# Altium project IMU V1.PrjPcb
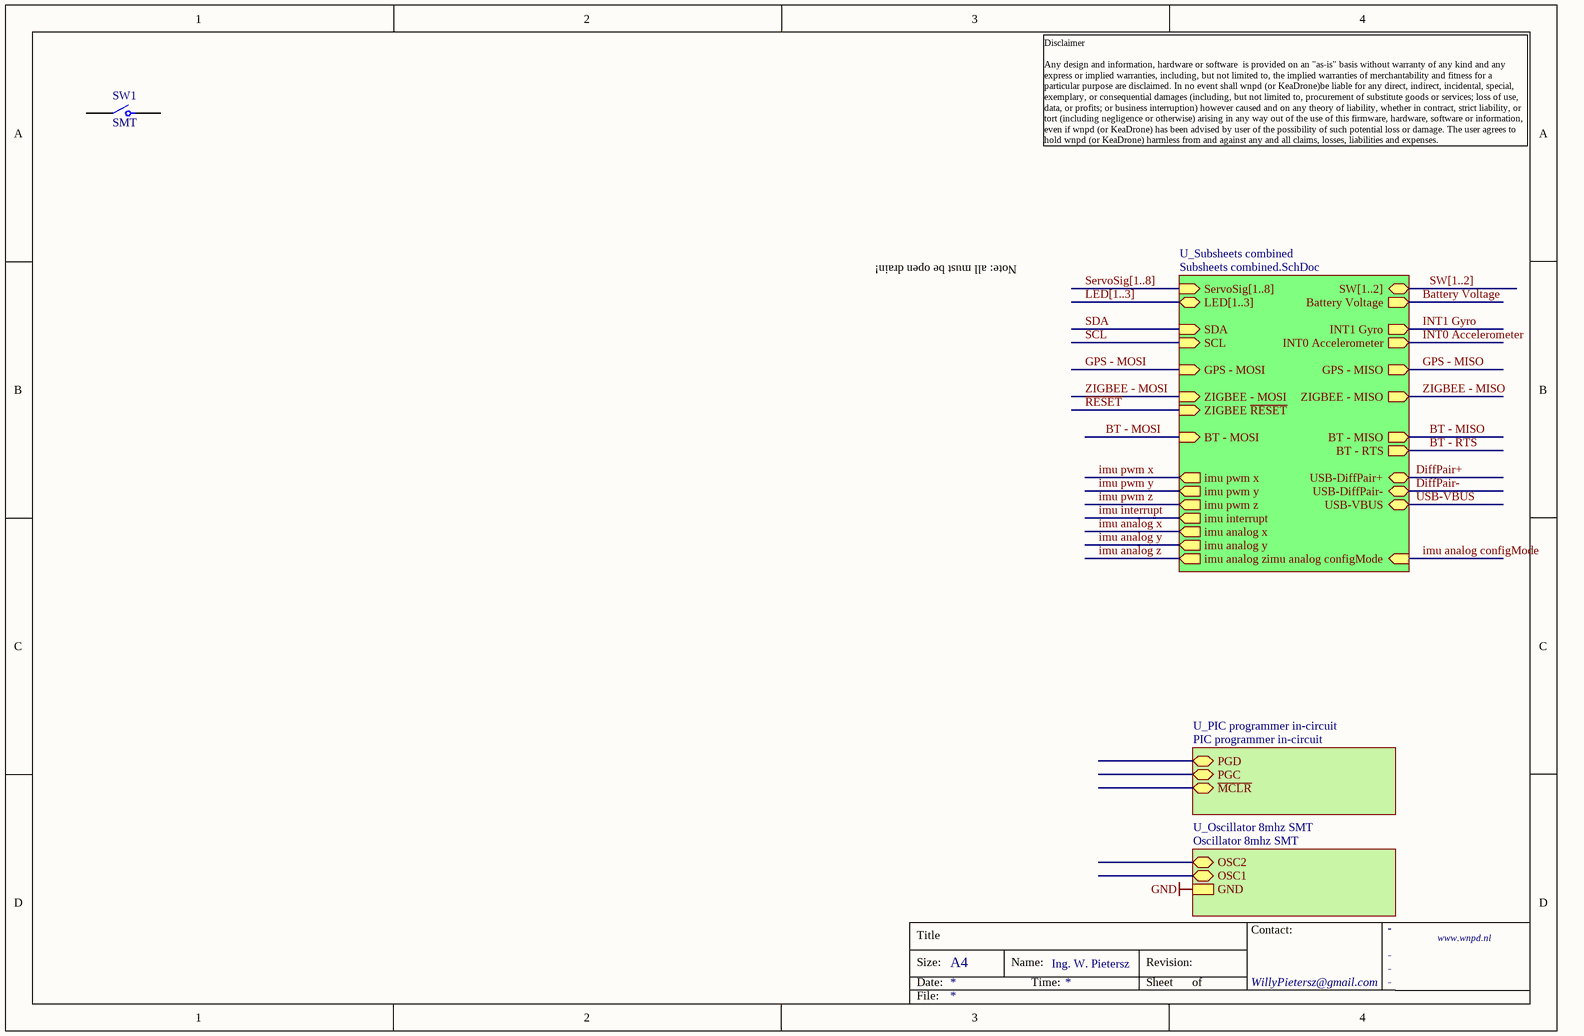
[diagram p0: main.SchDoc]
10 sheets, 75 parts. Net scope: hierarchical (ports join the sheet entries above them; power ports are global).
Board file: IMU V2.PcbDoc
Sheets:
  main.SchDoc
    U_Subsheets combined = Subsheets combined.SchDoc
      U_Accelerometer 3-AXIS - BMA180 = Accelerometer 3-AXIS - BMA180.SchDoc
      U_GYRO 3-AXIS - ITG-3200 = GYRO 3-AXIS - ITG-3200.SchDoc
      PSU 5v1A = SMPS 1000mA - LM22672.SchDoc
      PSU 3v3 = Regulator 3v3-250mA MCP1702.SchDoc
      PWR Entry = Power Entry 24v-3pin Fused-1A5.SchDoc
      PSU 3v3A = Regulator 3v3-250mA MCP1702.SchDoc
      U_Zigbee interface = Zigbee interface.SchDoc
        PSU 3v3-xBee = Regulator 3v3-250mA MCP1702.SchDoc
      ServoConnector1 = ServoConnector.SchDoc
      ServoConnector2 = ServoConnector.SchDoc
      ServoConnector3 = ServoConnector.SchDoc
      ServoConnector4 = ServoConnector.SchDoc
      ServoConnector5 = ServoConnector.SchDoc
      ServoConnector6 = ServoConnector.SchDoc
      ServoConnector7 = ServoConnector.SchDoc
      ServoConnector8 = ServoConnector.SchDoc
      U_GPS Connector - LS20031 = GPS Connector - LS20031.SchDoc

## Sheet main.SchDoc
size A4; PageSetup: Record=PageOptions|CenterHorizontal=True|CenterVertical=True|PrintScale=0.97|XCorrection=1.00|YCorrection=1.00|PrintKind=0|BorderSize=5000000|LeftOffset=0|BottomOffset=0|Orientation=2|PaperLength=1000|PaperWidth=1000|Scale=100|PaperSource=273|PrintQuality=-2|MediaType=1|DitherType=10|PaperKind=A4|PrintScaleMode=1; Organization: Altium Limited; Address1: 3 Minna Close; Address2: Belrose; Address3: NSW 2085; Address4: Australia

### Parts
SW1  SMT  [SWITCH TACT]

### Sub-sheets
U_Oscillator 8mhz SMT = Oscillator 8mhz SMT (file not in this document): OSC2 (bidir), OSC1 (bidir), GND
U_PIC programmer in-circuit = PIC programmer in-circuit (file not in this document): PGD (bidir), PGC (bidir), ~{MCLR} (bidir)
U_Subsheets combined = Subsheets combined.SchDoc: ServoSig[1..8], INT0 Accelerometer (out), INT1 Gyro (out), ZIGBEE - MISO (out), ZIGBEE - MOSI (in), ZIGBEE ~{RESET} (in), SDA (in), SCL (in), Battery Voltage (out), GPS - MISO (out), GPS - MOSI (in), USB-DiffPair+, USB-DiffPair-, USB-VBUS, LED[1..3] (bidir), SW[1..2], BT - MISO (out), BT - MOSI (in), BT - RTS (out), imu pwm x (out), imu pwm y (out), imu pwm z (out), imu interrupt (out), imu analog x (out), imu analog y (out), imu analog z (out), imu analog configMode (in)

### Nets
Battery Voltage: sheet U_Subsheets combined/Battery Voltage
BT - MISO: sheet U_Subsheets combined/BT - MISO
BT - MOSI: sheet U_Subsheets combined/BT - MOSI
BT - RTS: sheet U_Subsheets combined/BT - RTS
NetSW1_1: SW1.1 SW1.4
NetSW1_2: SW1.2 SW1.3

### Buses and harness runs
bus LED[1..3] = sheet U_Subsheets combined/LED[1..3]
bus ServoSig[1..8] = sheet U_Subsheets combined/ServoSig[1..8]
bus SW[1..2] = sheet U_Subsheets combined/SW[1..2]

### Notes on the sheet
- Note: all must be open drain!
- Disclaimer
  Any design and information, hardware or software  is provided on an "as-is" basis without warranty of any kind and any express or implied warranties, including, but not limited to, the implied warranties of merchantability and fitness for a particular purpose are disclaimed. In no event shall wnpd (or KeaDrone)be liable for any direct, indirect, incidental, special, exemplary, or consequential damages (including, but not limited to, procurement of substitute goods or services; loss of use, data, or profits; or business interruption) however caused and on any theory of liability, whether in contract, strict liability, or tort (including negligence or otherwise) arising in any way out of the use of this firmware, hardware, software or information, even if wnpd (or KeaDrone) has been advised by user of the possibility of such potential loss or damage. The user agrees to hold wnpd (or KeaDrone) harmless from and against any and all claims, losses, liabilities and expenses.
- Title
- Size:
- Date:
- A4
- Name:
- Time:
- Ing. W. Pietersz
- Revision:
- Sheet
- of
- WillyPietersz@gmail.com
- Contact:
- -
- www.wnpd.nl
- File:

### Library data of the parts
SW1 = Pushbutton TACT: Switch; Current: 0.1; Voltage: 42; LatestRevision Note: Initial Release; Part Number: Pushbutton TACT; Component Type: Switch; LatestRevision Date: 4-10-2010; Author: Willem Pietersz; Supplier 2: Farnell; Supplier Part Number 2: 1795335; Number Of Pins: 4

## Sheet Subsheets combined.SchDoc
size A4; Organization: Altium Limited; Address1: 3 Minna Close; Address2: Belrose; Address3: NSW 2085; Address4: Australia
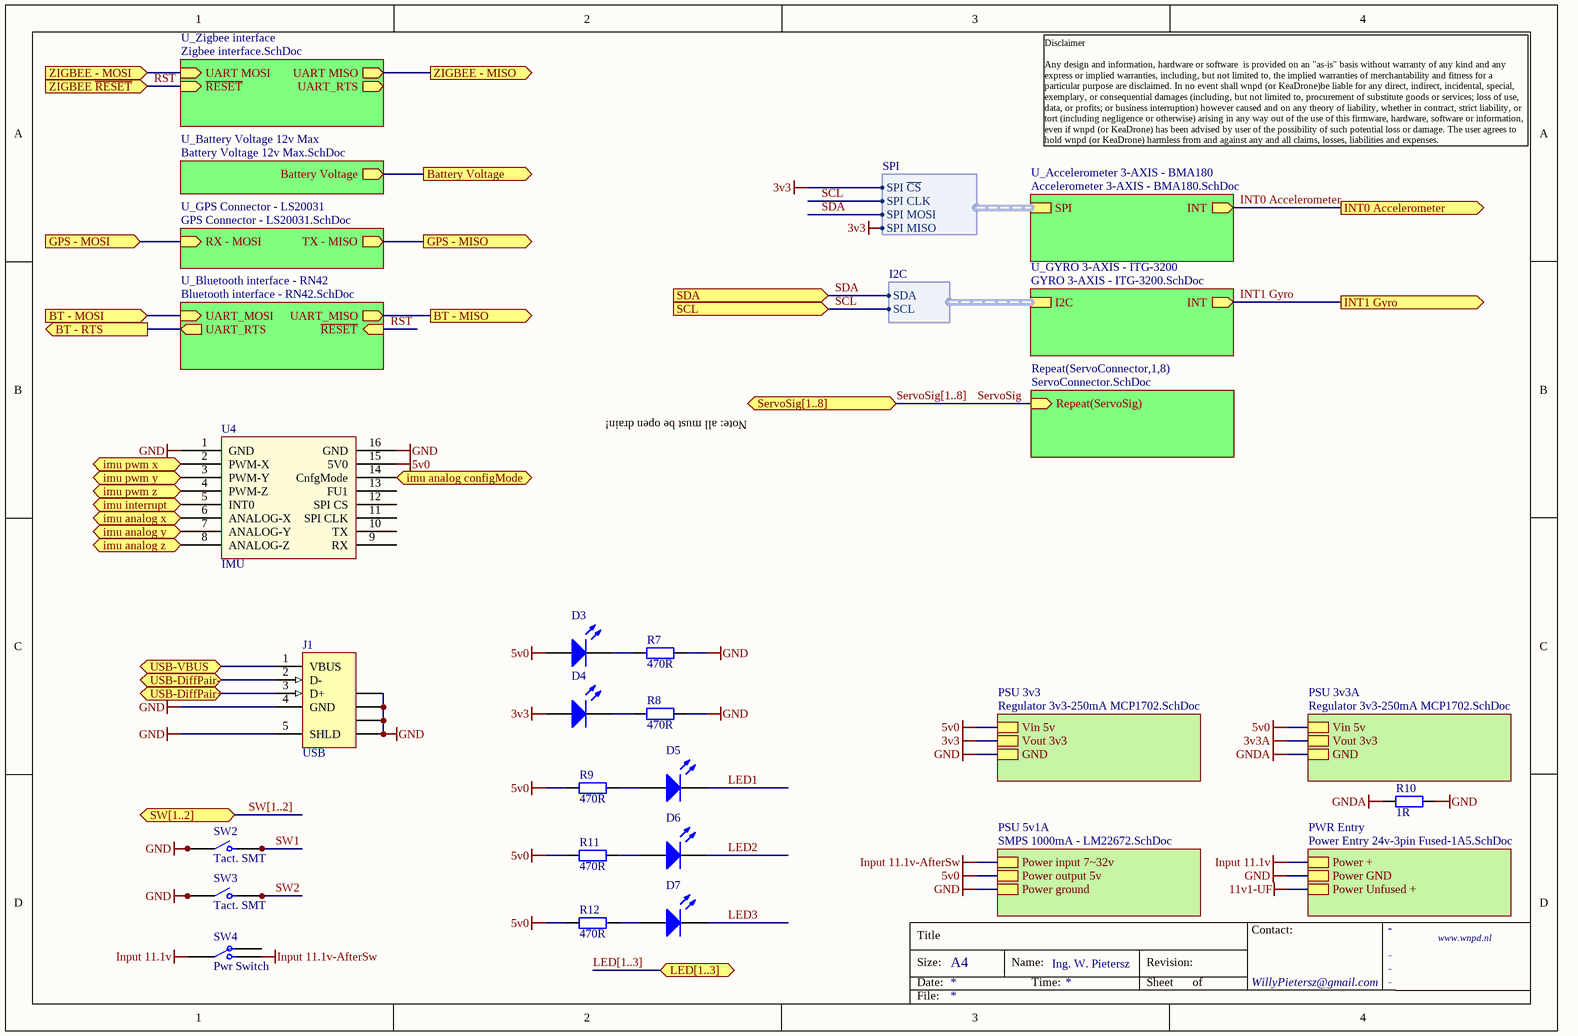
[diagram p1: Subsheets combined.SchDoc]

### Parts
D3  (no value)  [PLCC2]
D4  (no value)  [PLCC2]
D5  (no value)  [PLCC2]
D6  (no value)  [PLCC2]
D7  (no value)  [PLCC2]
J1  USB  [USBminiSMT]
R7  value 470R  [R0805]  (hidden comment: RESISTOR)
R8  value 470R  [R0805]  (hidden comment: RESISTOR)
R9  value 470R  [R0805]  (hidden comment: RESISTOR)
R10  value 1R  [R0805]  (hidden comment: RESISTOR)
R11  value 470R  [R0805]  (hidden comment: RESISTOR)
R12  value 470R  [R0805]  (hidden comment: RESISTOR)
SW2  Tact. SMT  [SWITCH TACT]
SW3  Tact. SMT  [SWITCH TACT]
SW4  Pwr Switch  [1MS1T1B5M1QE]
U4  IMU  [Keadrone_IMUv1]

### Sub-sheets
PSU 3v3 = Regulator 3v3-250mA MCP1702.SchDoc: Vin 5v, Vout 3v3, GND
PSU 3v3A = Regulator 3v3-250mA MCP1702.SchDoc: Vin 5v, Vout 3v3, GND
PSU 5v1A = SMPS 1000mA - LM22672.SchDoc: Power input 7~32v, Power output 5v, Power ground
PWR Entry = Power Entry 24v-3pin Fused-1A5.SchDoc: Power +, Power GND, Power Unfused +
Repeat(ServoConnector,1,8) = ServoConnector.SchDoc: Repeat(ServoSig) (in)
U_Accelerometer 3-AXIS - BMA180 = Accelerometer 3-AXIS - BMA180.SchDoc: INT (out), SPI (harness SPI)
U_Battery Voltage 12v Max = Battery Voltage 12v Max.SchDoc (file not in this document): Battery Voltage (out)
U_Bluetooth interface - RN42 = Bluetooth interface - RN42.SchDoc (file not in this document): UART_MOSI (in), UART_MISO (out), UART_RTS (out), ~{RESET} (in)
U_GPS Connector - LS20031 = GPS Connector - LS20031.SchDoc: RX - MOSI (in), TX - MISO (out)
U_GYRO 3-AXIS - ITG-3200 = GYRO 3-AXIS - ITG-3200.SchDoc: INT (out), I2C (harness I2C)
U_Zigbee interface = Zigbee interface.SchDoc: UART MISO (out), UART MOSI (in), ~{RESET} (in), UART_RTS (out)

### Ports
Battery Voltage (out), BT - MISO (out), BT - MOSI (in), BT - RTS (out), GPS - MISO (out), GPS - MOSI (in), imu analog configMode (in), imu analog x (out), imu analog y (out), imu analog z (out), imu interrupt (out), imu pwm x (out), imu pwm y (out), imu pwm z (out), INT0 Accelerometer (out), INT1 Gyro (out), LED[1..3] (bidir), SCL (in), SDA (in), ServoSig[1..8], SW[1..2], USB-DiffPair+, USB-DiffPair-, USB-VBUS, ZIGBEE - MISO (out), ZIGBEE - MOSI (in), ZIGBEE ~{RESET} (in)

### Harnesses
SPI: SPI ~{CS}, SPI CLK, SPI MOSI, SPI MISO
I2C: SDA, SCL

### Nets
3v3: D4.1(A) ; sheet PSU 3v3/Vout 3v3, sheet U_Accelerometer 3-AXIS - BMA180/SPI.SPI ~{CS}, sheet U_Accelerometer 3-AXIS - BMA180/SPI.SPI MISO  [project net CS1]
5v0: D3.1(A) R9.2 R11.2 R12.2 U4.15(5V0) ; sheet PSU 5v1A/Power output 5v, sheet PSU 3v3/Vin 5v, sheet PSU 3v3A/Vin 5v
GND: J1.4(GND) J1.5(SHLD) J1.6(SHLD) J1.7(SHLD) J1.8(SHLD) J1.9(SHLD) R7.1 R8.1 R10.2 SW2.1 SW2.4 SW3.1 SW3.4 U4.1(GND) U4.16(GND) ; sheet PSU 5v1A/Power ground, sheet PSU 3v3/GND, sheet PWR Entry/Power GND
GNDA: R10.1 ; sheet PSU 3v3A/GND
Input 11.1v: SW4.1 ; sheet PWR Entry/Power +
Input 11.1v-AfterSw: SW4.2 ; sheet PSU 5v1A/Power input 7~32v
Battery Voltage: port Battery Voltage, sheet U_Battery Voltage 12v Max/Battery Voltage
BT - MISO: port BT - MISO, sheet U_Bluetooth interface - RN42/UART_MISO
BT - MOSI: port BT - MOSI, sheet U_Bluetooth interface - RN42/UART_MOSI
BT - RTS: port BT - RTS, sheet U_Bluetooth interface - RN42/UART_RTS
DiffPair+: J1.3(D+) ; port USB-DiffPair+
DiffPair-: J1.2(D-) ; port USB-DiffPair-
GPS - MISO: port GPS - MISO, sheet U_GPS Connector - LS20031/TX - MISO
GPS - MOSI: port GPS - MOSI, sheet U_GPS Connector - LS20031/RX - MOSI
imu analog configMode: U4.14(CnfgMode) ; port imu analog configMode
imu analog x: U4.6(ANALOG-X) ; port imu analog x
imu analog y: U4.7(ANALOG-Y) ; port imu analog y
imu analog z: U4.8(ANALOG-Z) ; port imu analog z
imu interrupt: U4.5(INT0) ; port imu interrupt
imu pwm x: U4.2(PWM-X) ; port imu pwm x
imu pwm y: U4.3(PWM-Y) ; port imu pwm y
imu pwm z: U4.4(PWM-Z) ; port imu pwm z
INT0 Accelerometer: port INT0 Accelerometer, sheet U_Accelerometer 3-AXIS - BMA180/INT
INT1 Gyro: port INT1 Gyro, sheet U_GYRO 3-AXIS - ITG-3200/INT
LED1: D5.2(K)
LED2: D6.2(K)
LED3: D7.2(K)
RST: port ZIGBEE ~{RESET}, sheet U_Zigbee interface/~{RESET}, sheet U_Bluetooth interface - RN42/~{RESET}  [project net ~{RESET}]
SCL: port SCL, sheet U_Accelerometer 3-AXIS - BMA180/SPI.SPI CLK, sheet U_GYRO 3-AXIS - ITG-3200/I2C.SCL  [project net SCK]
SDA: port SDA, sheet U_Accelerometer 3-AXIS - BMA180/SPI.SPI MOSI, sheet U_GYRO 3-AXIS - ITG-3200/I2C.SDA
ServoSig: sheet Repeat(ServoConnector,1,8)/Repeat(ServoSig)
SW1: SW2.2 SW2.3
SW2: SW3.2 SW3.3
UART MISO: port ZIGBEE - MOSI, sheet U_Zigbee interface/UART MOSI
UART MOSI: port ZIGBEE - MISO, sheet U_Zigbee interface/UART MISO
USB-VBUS: J1.1(VBUS) ; port USB-VBUS
NetD3_2: D3.2(K) R7.2
NetD4_2: D4.2(K) R8.2
NetD5_1: D5.1(A) R9.1
NetD6_1: D6.1(A) R11.1
NetD7_1: D7.1(A) R12.1

Not connected (* = marked no-connect by the designer): SW4 3; U4 9(RX) 10(TX) 11(SPI_CLK) 12(SPI_CS) 13(FU1)

### Buses and harness runs
bus LED[1..3] = port LED[1..3]
bus ServoSig[1..8] = port ServoSig[1..8]
bus SW[1..2] = port SW[1..2]

### Notes on the sheet
- Note: all must be open drain!
- Disclaimer
  Any design and information, hardware or software  is provided on an "as-is" basis without warranty of any kind and any express or implied warranties, including, but not limited to, the implied warranties of merchantability and fitness for a particular purpose are disclaimed. In no event shall wnpd (or KeaDrone)be liable for any direct, indirect, incidental, special, exemplary, or consequential damages (including, but not limited to, procurement of substitute goods or services; loss of use, data, or profits; or business interruption) however caused and on any theory of liability, whether in contract, strict liability, or tort (including negligence or otherwise) arising in any way out of the use of this firmware, hardware, software or information, even if wnpd (or KeaDrone) has been advised by user of the possibility of such potential loss or damage. The user agrees to hold wnpd (or KeaDrone) harmless from and against any and all claims, losses, liabilities and expenses.
- Title
- Size:
- Date:
- A4
- Name:
- Time:
- Ing. W. Pietersz
- Revision:
- Sheet
- of
- WillyPietersz@gmail.com
- Contact:
- -
- www.wnpd.nl
- File:

### Library data of the parts
D3-D7 = Green-PLCC2: LED, Surface Mount LED Indicator; Type: Single_Indicator; Part Number: Green-PLCC2; Author: Willem Pietersz; ROHS: Y; Supplier 2: Farnell; Supplier Part Number 2: 1328317; ComponentLink2Description: Datasheet; ComponentLink2URL: http://cp.literature.agilent.com/litweb/pdf/5988-6546EN.pdf
J1 = USBmini: USBmini 2.0, Right Angle, SMT, B Type, Receptacle, 5 Position, Black; Note: Directive 2000/53/EC (ELV) Compliant; ContactMaterial: Copper Alloy; ContactPlating: Gold (30); PCB_Layout: Complies with manufacturer's recommendation.; DrillSize: Corresponds to nominal value.; PanelGround: Without; LatestRevision Note: Initial Release; Published: 15-Jul-2004; DatasheetDocument: 27-Jun-2003; PackageDocument: 27-Jun-2003; PackageReference: 440247; Publisher: Altium Limited; HousingMaterial: Thermoplastic; Part Number: USBmini; Number Of Pins: 5; Component Type: Standard; Author: Willem Pietersz; Supplier 2: Farnell
R7-R9 R11 R12 = 470R: Manufacturer 1: Panasonic; Manufacturer 1 Part No: ERJT06J471V; Power: 0.25W; Tolerance: 0.05; LatestRevision Note: Initial Release; Published: 8-Jun-2000; LatestRevisionDate: 17-Jul-2002; LatestRevisionNote: Re-released for DXP Platform.; PackageReference: AXIAL-0.4; Publisher: Altium Limited; Part Number: 470R; Type: Film; Package: 0805; Component Type: Standard; LatestRevision Date: 30-7-2010; Author: Willy Pietersz; ROHS: Y; Supplier 1: Farnell; Supplier Part Number 1: 1577367; ComponentLink1Description: Manufacturer; ComponentLink2Description: Datasheet
R10 = 1R: Manufacturer 1: Panasonic; Manufacturer 1 Part No: ERJT06J1R0V; Power: 0.25W; Tolerance: 0.05; LatestRevision Note: Initial Release; Published: 8-Jun-2000; LatestRevisionDate: 17-Jul-2002; LatestRevisionNote: Re-released for DXP Platform.; PackageReference: AXIAL-0.4; Publisher: Altium Limited; Part Number: 1R; Type: Film; Package: 0805; Component Type: Standard; LatestRevision Date: 30-7-2010; Author: Willy Pietersz; ROHS: Y; Supplier 2: Farnell; Supplier Part Number 2: 1618236; ComponentLink1Description: Manufacturer; ComponentLink2Description: Datasheet
SW2 SW3 = Pushbutton TACT: as SW1 on sheet main; Part Number: Pushbutton TACT; Component Type: Switch; LatestRevision Date: 4-10-2010; Author: Willem Pietersz; Supplier 1: Farnell; Supplier Part Number 1: 1795335; Number Of Pins: 4
SW4 = Toggle-Sw_1MS1T1B5M1QE: Switch; Current: 2; Voltage: 250; Part Number: Toggle-Sw_1MS1T1B5M1QE; Type: SPDT; Component Type: Switch; Supplier 1: Farnell; Supplier Part Number 1: 9473378; ComponentLink2Description: Datasheet; ComponentLink2URL: http://www.farnell.com/datasheets/650672.pdf; Number Of Pins: 3
U4 = Keadrone-imu-v1: Part Number: Keadrone-imu-v1; Component Type: Gyro, IMU

## Sheet Accelerometer 3-AXIS - BMA180.SchDoc: Accelerometer, 3-Axis - SPI
size A4; Organization: Altium Limited; Address1: 3 Minna Close; Address2: Belrose; Address3: NSW 2085; Address4: Australia
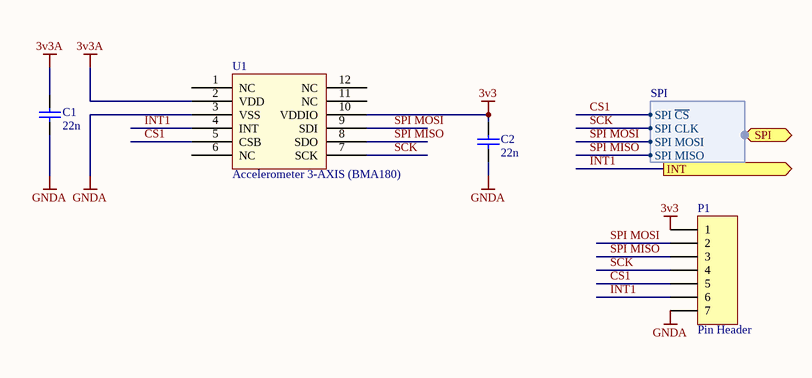
[diagram p2: Accelerometer 3-AXIS - BMA180.SchDoc]

### Parts
C1  22n  [C0805]
C2  22n  [C0805]
P1  Pin Header  [PH1x7_2.54]
U1  Accelerometer 3-AXIS (BMA180)  [BMA180]

### Ports
INT (out), SPI (harness SPI)

### Harnesses
SPI: SPI ~{CS}, SPI CLK, SPI MOSI, SPI MISO

### Nets
3v3A: C1.2 U1.2(VDD)
CS1: C2.2 P1.1 P1.3 P1.5 U1.5(CSB) U1.8(SDO) U1.10(VDDIO) ; port SPI.SPI ~{CS}, port SPI.SPI MISO  [also labelled 3v3, SPI MISO]
GNDA: C1.1 C2.1 P1.7 U1.3(VSS)
INT1: P1.6 U1.4(INT) ; port INT  [project net INT0 Accelerometer]
SCK: P1.4 U1.7(SCK) ; port SPI.SPI CLK
SPI MOSI: P1.2 U1.9(SDI) ; port SPI.SPI MOSI  [project net SDA]

Not connected (* = marked no-connect by the designer): U1 1(NC) 6(NC) 11(NC) 12(NC)

### Notes on the sheet
- Disclaimer
  Any design and information, hardware or software  is provided on an "as-is" basis without warranty of any kind and any express or implied warranties, including, but not limited to, the implied warranties of merchantability and fitness for a particular purpose are disclaimed. In no event shall wnpd (or KeaDrone)be liable for any direct, indirect, incidental, special, exemplary, or consequential damages (including, but not limited to, procurement of substitute goods or services; loss of use, data, or profits; or business interruption) however caused and on any theory of liability, whether in contract, strict liability, or tort (including negligence or otherwise) arising in any way out of the use of this firmware, hardware, software or information, even if wnpd (or KeaDrone) has been advised by user of the possibility of such potential loss or damage. The user agrees to hold wnpd (or KeaDrone) harmless from and against any and all claims, losses, liabilities and expenses.
- Title
- Size:
- Date:
- A4
- Name:
- Time:
- Ing. W. Pietersz
- Revision:
- Sheet
- of
- WillyPietersz@gmail.com
- Contact:
- -
- www.wnpd.nl
- File:

### Library data of the parts
C1 C2 = 22n: Tolerance: 0.1; LatestRevision Note: Initial Release; Part Number: 22n; Value: 22n; Package: 0805; Component Type: Standard; LatestRevision Date: 31-7-2010; Author: Willy Pietersz; ComponentLink1Description: Manufacturer; ComponentLink2Description: Datasheet
P1 = PH1x7: Con1x7; Part Number: PH1x7; Pitch: 2.54; LatestRevision Note: Initial Release; Type: Pin Header; Number Of Pins: 7; Component Type: Standard; LatestRevision Date: 23-11-2010; Author: Willy Pietersz; Supplier 2: Farnell
U1 = BMA180: Part Number: BMA180; Component Type: Sensor; Supplier 1: Digikey; Supplier Part Number 1: 828-1019-1-ND; ComponentLink1Description: Datasheet; ComponentLink1URL: http://www.bosch-sensortec.com/content/language1/downloads/BST-BMA180-FL000-03.pdf

## Sheet GYRO 3-AXIS - ITG-3200.SchDoc: Gyroscope, 3-Axis - I2C
size A4; Organization: Altium Limited; Address1: 3 Minna Close; Address2: Belrose; Address3: NSW 2085; Address4: Australia
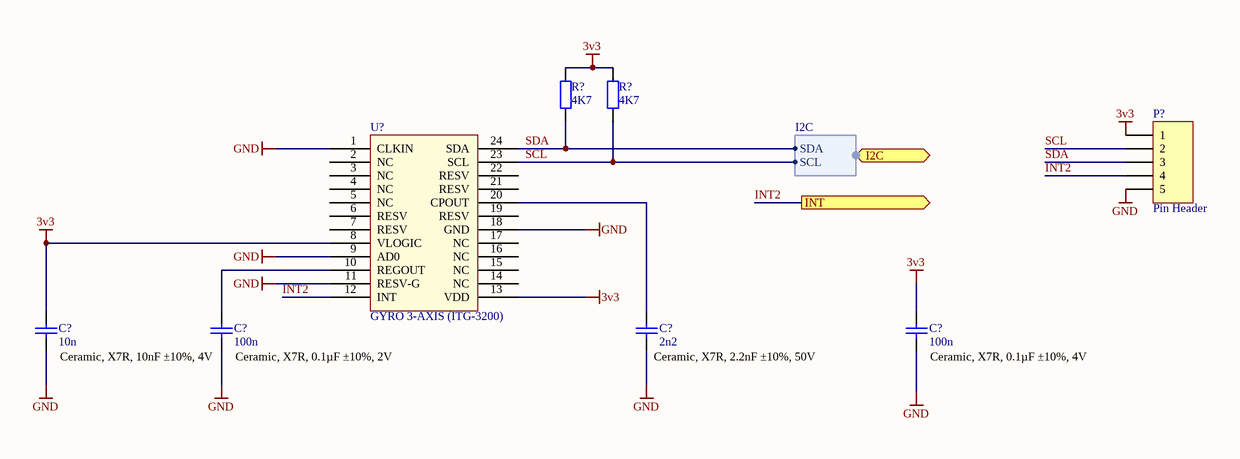
[diagram p3: GYRO 3-AXIS - ITG-3200.SchDoc]

### Parts
(Parts that share a designator on the sheet are numbered #1, #2 ... from top to bottom, then left to right.)
C?#1  10n  [C0805]
C?#2  100n  [C0805]
C?#3  2n2  [C0805]
C?#4  100n  [C0805]
P?  Pin Header  [PH1x5_2.54]
R?#1  value 4K7  [R0805]  (hidden comment: RESISTOR)
R?#2  value 4K7  [R0805]  (hidden comment: RESISTOR)
U?  GYRO 3-AXIS (ITG-3200)  [QFN50P400X400-24V2M - GYRO 3axis]

### Ports
I2C (harness I2C), INT (out)

### Harnesses
I2C: SDA, SCL

### Nets
3v3: C?#1.2 C?#4.2 P?.1 R?#1.1 R?#2.1 U?.8(VLOGIC) U?.13(VDD)  [project net CS1]
GND: C?#1.1 C?#2.1 C?#3.1 C?#4.1 P?.5 U?.1(CLKIN) U?.9(AD0) U?.11(RESV-G) U?.18(GND)
INT2: P?.4 U?.12(INT) ; port INT  [project net INT1 Gyro]
SCL: P?.2 R?#2.2 U?.23(SCL) ; port I2C.SCL  [project net SCK]
SDA: P?.3 R?#1.2 U?.24(SDA) ; port I2C.SDA
NetC?#2_2: C?#2.2 U?.10(REGOUT)
NetC?#3_2: C?#3.2 U?.20(CPOUT)

Not connected (* = marked no-connect by the designer): U? 2(NC) 3(NC) 4(NC) 5(NC) 6(RESV) 7(RESV) 14(NC) 15(NC) 16(NC) 17(NC) 19(RESV) 21(RESV) 22(RESV)

### Notes on the sheet
- (near C?#2) Ceramic, X7R, 10nF ±10%, 4V
- (near C?#2) Ceramic, X7R, 0.1µF ±10%, 2V
- (near C?#3) Ceramic, X7R, 2.2nF ±10%, 50V
- (near C?#4) Ceramic, X7R, 0.1µF ±10%, 4V
- Disclaimer
  Any design and information, hardware or software  is provided on an "as-is" basis without warranty of any kind and any express or implied warranties, including, but not limited to, the implied warranties of merchantability and fitness for a particular purpose are disclaimed. In no event shall wnpd (or KeaDrone)be liable for any direct, indirect, incidental, special, exemplary, or consequential damages (including, but not limited to, procurement of substitute goods or services; loss of use, data, or profits; or business interruption) however caused and on any theory of liability, whether in contract, strict liability, or tort (including negligence or otherwise) arising in any way out of the use of this firmware, hardware, software or information, even if wnpd (or KeaDrone) has been advised by user of the possibility of such potential loss or damage. The user agrees to hold wnpd (or KeaDrone) harmless from and against any and all claims, losses, liabilities and expenses.
- Title
- Size:
- Date:
- A4
- Name:
- Time:
- Ing. W. Pietersz
- Revision:
- Sheet
- of
- WillyPietersz@gmail.com
- Contact:
- -
- www.wnpd.nl
- File:

### Library data of the parts
C?#1 = 10n: Tolerance: 0.1; LatestRevision Note: Initial Release; Part Number: 10n; Value: 10n; Package: 0805; Component Type: Standard; LatestRevision Date: 31-7-2010; Author: Willy Pietersz; ComponentLink1Description: Manufacturer; ComponentLink2Description: Datasheet
C?#2 C?#4 = 100n: Tolerance: 0.1; LatestRevision Note: Initial Release; Part Number: 100n; Value: 100n; Package: 0805; Component Type: Standard; LatestRevision Date: 31-7-2010; Author: Willy Pietersz; Supplier 2: Farnell; Supplier Part Number 2: 1759266; ComponentLink1Description: Manufacturer; ComponentLink2Description: Datasheet
C?#3 = 2n2: Tolerance: 0.1; LatestRevision Note: Initial Release; Part Number: 2n2; Value: 2n2; Package: 0805; Component Type: Standard; LatestRevision Date: 31-7-2010; Author: Willy Pietersz; ComponentLink1Description: Manufacturer; ComponentLink2Description: Datasheet
P? = PH1x5: Con1x5; Part Number: PH1x5; Pitch: 2.54; LatestRevision Note: Initial Release; Type: Pin Header; Number Of Pins: 5; Component Type: Standard; LatestRevision Date: 23-11-2010; Author: Willy Pietersz; Supplier 2: Farnell
R?#1 R?#2 = 4K7: Manufacturer 1: Panasonic; Manufacturer 1 Part No: ERJT06J472V; Power: 0.25W; Tolerance: 0.05; LatestRevision Note: Initial Release; Published: 8-Jun-2000; LatestRevisionDate: 17-Jul-2002; LatestRevisionNote: Re-released for DXP Platform.; PackageReference: AXIAL-0.4; Publisher: Altium Limited; Part Number: 4K7; Type: Film; Package: 0805; Component Type: Standard; LatestRevision Date: 30-7-2010; Author: Willy Pietersz; ROHS: Y; Supplier 2: Farnell; Supplier Part Number 2: 1577368; ComponentLink1Description: Manufacturer; ComponentLink2Description: Datasheet
U? = ITG-3200: Gyro, 3-axis; Part Number: ITG-3200; Component Type: Sensor; Supplier 1: Sparkfun; Supplier Part Number 1: ITG-3200; ComponentLink1Description: Datasheet; ComponentLink1URL: http://www.sparkfun.com/datasheets/Sensors/Gyro/PS-ITG-3200-00-01.4.pdf

## Sheet SMPS 1000mA - LM22672.SchDoc: SMPS 5v 1A - low ripple
size A4; Organization: Altium Limited; Address1: 3 Minna Close; Address2: Belrose; Address3: NSW 2085; Address4: Australia
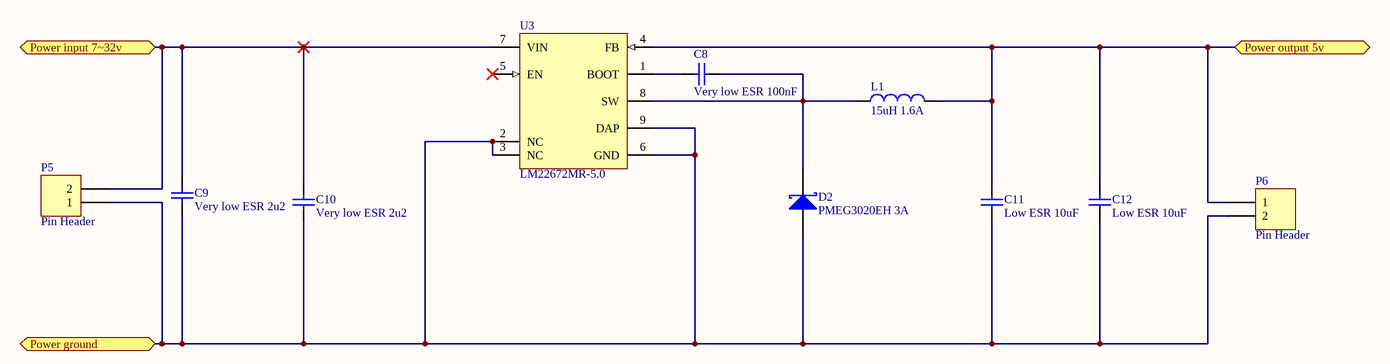
[diagram p4: SMPS 1000mA - LM22672.SchDoc]

### Parts
C8  Very low ESR 100nF  [C0805]
C9  Very low ESR 2u2  [C1210]
C10  Very low ESR 2u2  [C1210]
C11  Low ESR 10uF  [C1210]
C12  Low ESR 10uF  [C1210]
D2  PMEG3020EH 3A  [SOD123F]
L1  value 15uH 1.6A  [Square_7.3x7.3x4.5]  (hidden comment: inductor)
P5  Pin Header  [PH1x2_2.54]
P6  Pin Header  [PH1x2_2.54]
U3  LM22672MR-5.0  [MRA08B_N]

### Ports
Power ground, Power input 7~32v, Power output 5v

### Nets
5v0: C11.2 C12.2 L1.2 P6.1 U3.4(FB) ; port Power output 5v
GND: C9.1 C10.1 C11.1 C12.1 D2.1 P5.1 P6.2 U3.2(NC) U3.3(NC) U3.6(GND) U3.9(DAP) ; port Power ground
Input 11.1v-AfterSw: C9.2 C10.2 P5.2 U3.7(VIN) ; port Power input 7~32v
NetC8_1: C8.1 U3.1(BOOT)
NetC8_2: C8.2 D2.2 L1.1 U3.8(SW)

Not connected (* = marked no-connect by the designer): U3 5(EN)*

### Notes on the sheet
- Disclaimer
  Any design and information, hardware or software  is provided on an "as-is" basis without warranty of any kind and any express or implied warranties, including, but not limited to, the implied warranties of merchantability and fitness for a particular purpose are disclaimed. In no event shall wnpd (or KeaDrone)be liable for any direct, indirect, incidental, special, exemplary, or consequential damages (including, but not limited to, procurement of substitute goods or services; loss of use, data, or profits; or business interruption) however caused and on any theory of liability, whether in contract, strict liability, or tort (including negligence or otherwise) arising in any way out of the use of this firmware, hardware, software or information, even if wnpd (or KeaDrone) has been advised by user of the possibility of such potential loss or damage. The user agrees to hold wnpd (or KeaDrone) harmless from and against any and all claims, losses, liabilities and expenses.
- Title
- Size:
- Date:
- A4
- Name:
- Time:
- Ing. W. Pietersz
- Revision:
- Sheet
- of
- WillyPietersz@gmail.com
- Contact:
- -
- www.wnpd.nl
- File:

### Library data of the parts
C8 = 0.01uF-0805-X7R: Voltage: 50V; Type: X7R; Tolerance: 0.1; Part Number: 0.01uF-0805-X7R; Value: 0.01uF-0805-X7R; Package: 0805; Component Type: Low ESR; LatestRevision Date: 14-9-2010; Author: Willem Pietersz; Supplier 2: Farnell; Supplier Part Number 2: 1692287
C9 C10 = 2.2uF-1210-X7R: Voltage: 50V; Type: X7R; Tolerance: 0.1; Part Number: 2.2uF-1210-X7R; Value: 2.2uF-1210-X7R; Package: 1210; Component Type: Low ESR; LatestRevision Date: 14-9-2010; Author: Willem Pietersz; Supplier 2: Farnell; Supplier Part Number 2: 1414066
C11 C12 = 10uF-1210-X5R: Voltage: 10V; Type: X5R; Tolerance: 0.1; Part Number: 10uF-1210-X5R; Value: 10uF-1210-X5R; Package: 1210; Component Type: Low ESR; LatestRevision Date: 14-9-2010; Author: Willem Pietersz; Supplier 2: Farnell; Supplier Part Number 2: 1759458
D2 = PMEG3020EH: Voltage: 30V; Current: 2A; Part Number: PMEG3020EH; Type: Schottky; Component Type: Standard; Supplier 2: Farnell; Supplier Part Number 2: 1510687; ComponentLink2Description: Datasheet; ComponentLink2URL: http://www.nxp.com/documents/data_sheet/PMEG3020EH_EJ.pdf
L1 = 15uH-Shield-1.6A-Wurth: Type: Shielded; Part Number: 15uH-Shield-1.6A-Wurth; Supplier 2: Farnell; Supplier Part Number 2: 1635989; ComponentLink2Description: Datasheet; ComponentLink2URL: http://www.farnell.com/datasheets/69698.pdf
P5 P6 = PH1x2: Con1x2; Part Number: PH1x2; Pitch: 2.54; LatestRevision Note: Initial Release; Type: Pin Header; Number Of Pins: 2; Component Type: Standard; LatestRevision Date: 23-11-2010; Author: Willy Pietersz; Supplier 2: Farnell
U3 = LM22674MR-5.0: Power, 500mA SIMPLE SWITCHER, Step-Down Voltage Regulator with Precision Enable; Manufacturer: National Semiconductor; PackageTopMarking: NSXYTT*L22674*5.0; PowerWise: N; FirstPublished: 4-Dec-2008; DatasheetVersion: Oct-2008; PackageVersion: revB, Dec-2007; PackageReference: MRA08B; Publisher: Altium Limited; PackageDescription: Molded, PSOP .193 x .154 x .058in, 8 Lead, .050in Pitch, Large DAP; CompType: Switcher; PartNumber: LM22674MR-5.0; RoHS: Y; PinCount: 8; DigiKeyPartNumber: LM22674MR-5.0-ND; Code_JEDEC: MS-012-AA; ComponentLink1Description: LM22674 Datasheet; ComponentLink1URL: http://www.national.com/ds/LM/LM22674.pdf; ComponentLink2Description: LM22674 Web Page; ComponentLink2URL: http://www.national.com/pf/LM/LM22674.html; ComponentLink3Description: MRA08B Package Drawing; ComponentLink3URL: http://www.national.com/packaging/folders/mra08b.html

## Sheet Regulator 3v3-250mA MCP1702.SchDoc: Regulator 3v3 out
size A4; Organization: Altium Limited; Address1: 3 Minna Close; Address2: Belrose; Address3: NSW 2085; Address4: Australia
Used 3 times, as channels U_Subsheets combined/PSU 3v3, U_Subsheets combined/PSU 3v3A, U_Subsheets combined/U_Zigbee interface/PSU 3v3-xBee. Parts and nets are listed once, with the designators drawn on the sheet.
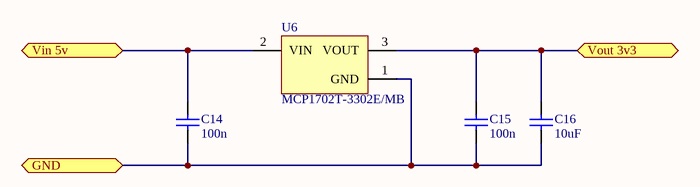
[diagram p5: Regulator 3v3-250mA MCP1702.SchDoc]

### Parts
C14  100n  [C0805]
C15  100n  [C0805]
C16  10uF  [C1206]
U6  MCP1702T-3302E/MB  [SOT-89-MB3_N]

### Ports
GND, Vin 5v, Vout 3v3

### Nets
GND: C14.1 C15.1 C16.1 U6.1(GND) ; port GND
Vin 5v: C14.2 U6.2(VIN) ; port Vin 5v
Vout 3v3: C15.2 C16.2 U6.3(VOUT) ; port Vout 3v3

### Channels
U_Subsheets combined/PSU 3v3: designators end in A; ports GND=GND Vin 5v=5v0 Vout 3v3=CS1
U_Subsheets combined/PSU 3v3A: designators end in B; ports GND=GNDA Vin 5v=5v0 Vout 3v3=3v3A
U_Subsheets combined/U_Zigbee interface/PSU 3v3-xBee: designators end in C; ports GND=GND Vin 5v=5v0 Vout 3v3=3v3-zigbee

### Notes on the sheet
- Disclaimer
  Any design and information, hardware or software  is provided on an "as-is" basis without warranty of any kind and any express or implied warranties, including, but not limited to, the implied warranties of merchantability and fitness for a particular purpose are disclaimed. In no event shall wnpd (or KeaDrone)be liable for any direct, indirect, incidental, special, exemplary, or consequential damages (including, but not limited to, procurement of substitute goods or services; loss of use, data, or profits; or business interruption) however caused and on any theory of liability, whether in contract, strict liability, or tort (including negligence or otherwise) arising in any way out of the use of this firmware, hardware, software or information, even if wnpd (or KeaDrone) has been advised by user of the possibility of such potential loss or damage. The user agrees to hold wnpd (or KeaDrone) harmless from and against any and all claims, losses, liabilities and expenses.
- Title
- Size:
- Date:
- A4
- Name:
- Time:
- Ing. W. Pietersz
- Revision:
- Sheet
- of
- WillyPietersz@gmail.com
- Contact:
- -
- www.wnpd.nl
- File:

### Library data of the parts
C14 C15 = 100n: as C?#2 on sheet GYRO 3-AXIS - ITG-3200; Part Number: 100n; Value: 100n; Package: 0805; Component Type: Standard; LatestRevision Date: 31-7-2010; Author: Willy Pietersz; Supplier 2: Farnell; Supplier Part Number 2: 1759266; ComponentLink1Description: Manufacturer; ComponentLink2Description: Datasheet
C16 = 10uF: Voltage: 10V; Type: Ceramic; Tolerance: 0.1; LatestRevision Note: Initial Release; Part Number: 10uF; Value: 10uF; Package: 1206; Component Type: Standard; LatestRevision Date: 14-9-2010; Author: Willem Pietersz; Supplier 2: Farnell; Supplier Part Number 2: 1759434; ComponentLink1Description: Manufacturer; ComponentLink2Description: Datasheet
U6 = MCP1702T-3302E/MB: Power, 250 mA Low Quiescent Current LDO Regulator, 3-Pin SOT-89, Extended Temperature, Tape and Reel; FirstPublished: 29-Jan-2009; LatestRevisionDate: 02-Dec-2009; LatestRevisionNote: Updated to datasheet revision D, Jun-2009; DatasheetVersion: revD, Jun-2009; PackageVersion: revBB, Aug-2009; PackageReference: SOT-89-MB3; Publisher: Altium Limited; PackageDescription: 3-Lead Plastic Small Outline Transistor Header (MB) [SOT-89]; Supplier 1: Digi-Key; Supplier Part Number 1: MCP1702T-3302E/MB-ND; Supplier 2: Farnell; Supplier Part Number 2: 1605558; Supplier 3: Newark; Supplier Part Number 3: 56K6993; Code_IPC: SOT89; ComponentLink1Description: Datasheet; ComponentLink1URL: http://ww1.microchip.com/downloads/en/DeviceDoc/22008d.pdf; ComponentLink2Description: Packaging Specification; ComponentLink2URL: http://www.microchip.com/stellent/groups/techpub_sg/documents/packagingspec/en012702.pdf; ComponentLink3Description: Microchip.com Home; ComponentLink3URL: http://www.microchip.com/

## Sheet Power Entry 24v-3pin Fused-1A5.SchDoc: Power Supply Entry
size A4; Organization: Altium Limited; Address1: 3 Minna Close; Address2: Belrose; Address3: NSW 2085; Address4: Australia
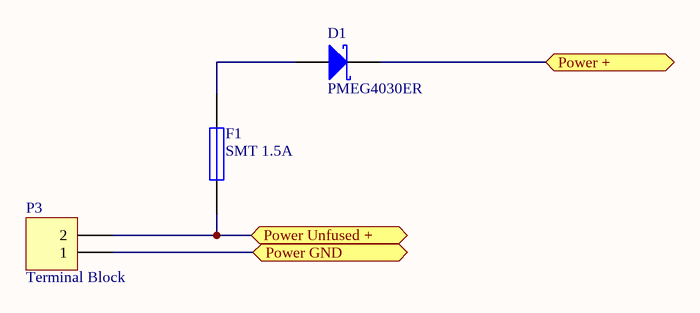
[diagram p6: Power Entry 24v-3pin Fused-1A5.SchDoc]

### Parts
D1  PMEG4030ER  [SOD123W]
F1  SMT 1.5A  [F_2920L185]
P3  Terminal Block  [TB2_3.5]

### Ports
Power +, Power GND, Power Unfused +

### Nets
11v1-UF: F1.1 P3.2 ; port Power Unfused +
GND: P3.1 ; port Power GND
Input 11.1v: D1.2 ; port Power +
NetD1_1: D1.1 F1.2

### Notes on the sheet
- Disclaimer
  Any design and information, hardware or software  is provided on an "as-is" basis without warranty of any kind and any express or implied warranties, including, but not limited to, the implied warranties of merchantability and fitness for a particular purpose are disclaimed. In no event shall wnpd (or KeaDrone)be liable for any direct, indirect, incidental, special, exemplary, or consequential damages (including, but not limited to, procurement of substitute goods or services; loss of use, data, or profits; or business interruption) however caused and on any theory of liability, whether in contract, strict liability, or tort (including negligence or otherwise) arising in any way out of the use of this firmware, hardware, software or information, even if wnpd (or KeaDrone) has been advised by user of the possibility of such potential loss or damage. The user agrees to hold wnpd (or KeaDrone) harmless from and against any and all claims, losses, liabilities and expenses.
- Title
- Size:
- Date:
- A4
- Name:
- Time:
- Ing. W. Pietersz
- Revision:
- Sheet
- of
- WillyPietersz@gmail.com
- Contact:
- -
- www.wnpd.nl
- File:

### Library data of the parts
D1 = PMEG4030ER: Voltage: 40V; Current: 3A; LatestRevision Note: Initial Release; Part Number: PMEG4030ER; Type: Schottky; Package: SOD123W; Component Type: Standard; LatestRevision Date: 29-9-2010 9:43:01; Author: Willem Pietersz; ROHS: Y; Supplier 2: Farnell; Supplier Part Number 2: 1829202; ComponentLink2Description: Datasheet; ComponentLink2URL: http://www.nxp.com/documents/data_sheet/PMEG4030ER.pdf
F1 = 2920L185: Fuse; Manufacturer 1: Littlefuse; Voltage: 30V; Published: 8-Jun-2000; LatestRevisionDate: 17-Jul-2002; LatestRevisionNote: Re-released for DXP Platform.; PackageReference: PIN-W2/E2.8; Publisher: Altium Limited; Part Number: 2920L185; Current: 1.5A; Manufacturer 1 Part No: 2920L185; Supplier 2: Farnell; Supplier Part Number 2: 1822228; ComponentLink1Description: Datasheet; ComponentLink1URL: http://www.farnell.com/datasheets/578244.pdf
P3 = TB2: Con1x2; Part Number: TB2; Current: 10; Voltage: 300; Pitch: 3,5; LatestRevision Note: Initial Release; Type: Terminal Block; Number Of Pins: 2; Component Type: Standard; LatestRevision Date: 23-11-2010; Author: Willy Pietersz; Supplier 2: Farnell

## Sheet Zigbee interface.SchDoc: Xbee with dedicated PSU
size A4; Organization: Altium Limited; Address1: 3 Minna Close; Address2: Belrose; Address3: NSW 2085; Address4: Australia
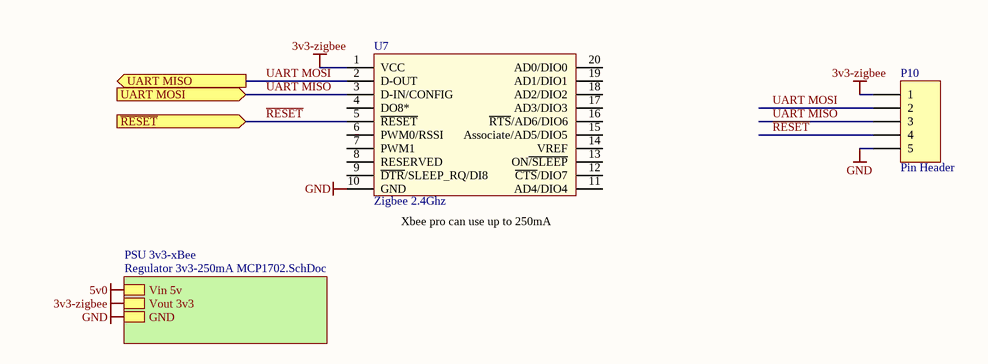
[diagram p7: Zigbee interface.SchDoc]

### Parts
P10  Pin Header  [PH1x5_2.54]
U7  Zigbee 2.4Ghz  [Zigbee_maxstream]

### Sub-sheets
PSU 3v3-xBee = Regulator 3v3-250mA MCP1702.SchDoc: Vin 5v, Vout 3v3, GND

### Ports
UART MISO (out), UART MOSI (in), ~{RESET} (in)

### Nets
3v3-zigbee: P10.1 U7.1(VCC) ; sheet PSU 3v3-xBee/Vout 3v3
GND: P10.5 U7.10(GND) ; sheet PSU 3v3-xBee/GND
~{RESET}: P10.4 U7.5(~{RESET}) ; port ~{RESET}
UART MISO: P10.3 U7.3(D-IN/CONFIG) ; port UART MOSI
UART MOSI: P10.2 U7.2(D-OUT) ; port UART MISO

Not connected (* = marked no-connect by the designer): U7 4(DO8*) 6(PWM0/RSSI) 7(PWM1) 8(RESERVED) 9(~{DTR}/SLEEP_RQ/DI8) 11(AD4/DIO4) 12(~{CTS}/DIO7) 13(ON~{/SLEEP}) 14(VREF) 15(Associate/AD5/DIO5) 16(~{RTS}/AD6/DIO6) 17(AD3/DIO3) 18(AD2/DIO2) 19(AD1/DIO1) 20(AD0/DIO0)

### Notes on the sheet
- (near U7) Xbee pro can use up to 250mA
- Disclaimer
  Any design and information, hardware or software  is provided on an "as-is" basis without warranty of any kind and any express or implied warranties, including, but not limited to, the implied warranties of merchantability and fitness for a particular purpose are disclaimed. In no event shall wnpd (or KeaDrone)be liable for any direct, indirect, incidental, special, exemplary, or consequential damages (including, but not limited to, procurement of substitute goods or services; loss of use, data, or profits; or business interruption) however caused and on any theory of liability, whether in contract, strict liability, or tort (including negligence or otherwise) arising in any way out of the use of this firmware, hardware, software or information, even if wnpd (or KeaDrone) has been advised by user of the possibility of such potential loss or damage. The user agrees to hold wnpd (or KeaDrone) harmless from and against any and all claims, losses, liabilities and expenses.
- Title
- Size:
- Date:
- A4
- Name:
- Time:
- Ing. W. Pietersz
- Revision:
- Sheet
- of
- WillyPietersz@gmail.com
- Contact:
- -
- www.wnpd.nl
- File:

### Library data of the parts
P10 = PH1x5: as P? on sheet GYRO 3-AXIS - ITG-3200; Type: Pin Header; Number Of Pins: 5; Component Type: Standard; LatestRevision Date: 23-11-2010; Author: Willy Pietersz; Supplier 2: Farnell
U7 = Zigbee-WRL-08690: Wireless, zigbee module from Maxstream;; Part Number: Zigbee-WRL-08690; Component Type: Wireless, Zigbee; ComponentLink1Description: Datasheet; ComponentLink1URL: http://www.sparkfun.com/datasheets/Wireless/Zigbee/XBee-Datasheet.pdf

## Sheet ServoConnector.SchDoc: Servo connector in/out
size A4; Organization: Altium Limited; Address1: 3 Minna Close; Address2: Belrose; Address3: NSW 2085; Address4: Australia
Used 8 times, as channels U_Subsheets combined/ServoConnector1, U_Subsheets combined/ServoConnector2, U_Subsheets combined/ServoConnector3, U_Subsheets combined/ServoConnector4, U_Subsheets combined/ServoConnector5, U_Subsheets combined/ServoConnector6, U_Subsheets combined/ServoConnector7, U_Subsheets combined/ServoConnector8. Parts and nets are listed once, with the designators drawn on the sheet.
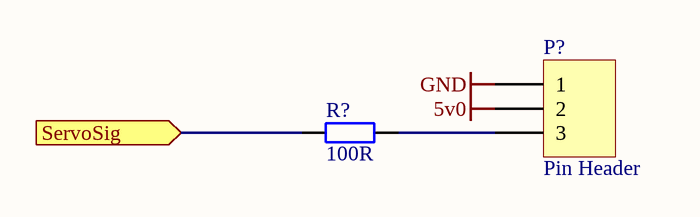
[diagram p8: ServoConnector.SchDoc]

### Parts
P?  Pin Header  [PH1x3_2.54]
R?  value 100R  [R0805]  (hidden comment: RESISTOR)

### Ports
ServoSig (in)

### Nets
5v0: P?.2
GND: P?.1
ServoSig: R?.2 ; port ServoSig
NetP?_3: P?.3 R?.1

### Channels
U_Subsheets combined/ServoConnector1: designators end in A; ports ServoSig=ServoSig1
U_Subsheets combined/ServoConnector2: designators end in B; ports ServoSig=ServoSig2
U_Subsheets combined/ServoConnector3: designators end in C; ports ServoSig=ServoSig3
U_Subsheets combined/ServoConnector4: designators end in D; ports ServoSig=ServoSig4
U_Subsheets combined/ServoConnector5: designators end in E; ports ServoSig=ServoSig5
U_Subsheets combined/ServoConnector6: designators end in F; ports ServoSig=ServoSig6
U_Subsheets combined/ServoConnector7: designators end in G; ports ServoSig=ServoSig7
U_Subsheets combined/ServoConnector8: designators end in H; ports ServoSig=ServoSig8

### Notes on the sheet
- Disclaimer
  Any design and information, hardware or software  is provided on an "as-is" basis without warranty of any kind and any express or implied warranties, including, but not limited to, the implied warranties of merchantability and fitness for a particular purpose are disclaimed. In no event shall wnpd (or KeaDrone)be liable for any direct, indirect, incidental, special, exemplary, or consequential damages (including, but not limited to, procurement of substitute goods or services; loss of use, data, or profits; or business interruption) however caused and on any theory of liability, whether in contract, strict liability, or tort (including negligence or otherwise) arising in any way out of the use of this firmware, hardware, software or information, even if wnpd (or KeaDrone) has been advised by user of the possibility of such potential loss or damage. The user agrees to hold wnpd (or KeaDrone) harmless from and against any and all claims, losses, liabilities and expenses.
- Title
- Size:
- Date:
- A4
- Name:
- Time:
- Ing. W. Pietersz
- Revision:
- Sheet
- of
- WillyPietersz@gmail.com
- Contact:
- -
- www.wnpd.nl
- File:

### Library data of the parts
P? = PH1x3: Con1x3; Part Number: PH1x3; Pitch: 2.54; LatestRevision Note: Initial Release; Type: Pin Header; Number Of Pins: 3; Component Type: Standard; LatestRevision Date: 23-11-2010; Author: Willy Pietersz; Supplier 2: Farnell
R? = 100R: Manufacturer 1: Panasonic; Manufacturer 1 Part No: ERJT06J101V; Power: 0.25W; Tolerance: 0.05; LatestRevision Note: Initial Release; Published: 8-Jun-2000; LatestRevisionDate: 17-Jul-2002; LatestRevisionNote: Re-released for DXP Platform.; PackageReference: AXIAL-0.4; Publisher: Altium Limited; Part Number: 100R; Type: Film; Package: 0805; Component Type: Standard; LatestRevision Date: 30-7-2010; Author: Willy Pietersz; ROHS: Y; Supplier 2: Farnell; Supplier Part Number 2: 1618240; ComponentLink1Description: Manufacturer; ComponentLink2Description: Datasheet

## Sheet GPS Connector - LS20031.SchDoc: GPS Connector
size A4; Organization: Altium Limited; Address1: 3 Minna Close; Address2: Belrose; Address3: NSW 2085; Address4: Australia
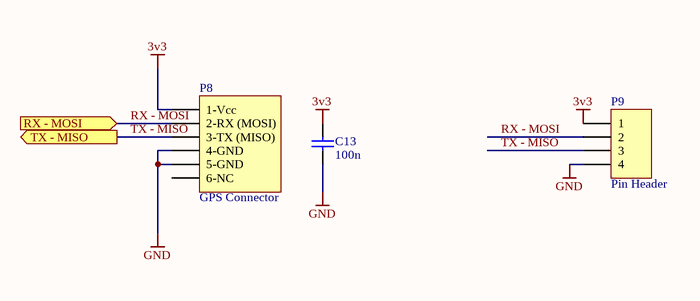
[diagram p9: GPS Connector - LS20031.SchDoc]

### Parts
C13  100n  [C0805]
P8  GPS Connector  [GPScon-BM06B-SRSS-TB]
P9  Pin Header  [PH1x4_2.54]

### Ports
RX - MOSI (in), TX - MISO (out)

### Nets
3v3: C13.2 P8.A1(1-Vcc) P9.1  [project net CS1]
GND: C13.1 P8.0 P8.A4(4-GND) P8.A5(5-GND) P9.4
RX - MOSI: P8.A2(2-RX_(MOSI)) P9.2 ; port RX - MOSI  [project net GPS - MOSI]
TX - MISO: P8.A3(3-TX_(MISO)) P9.3 ; port TX - MISO  [project net GPS - MISO]

Not connected (* = marked no-connect by the designer): P8 A6(6-NC)

### Notes on the sheet
- Disclaimer
  Any design and information, hardware or software  is provided on an "as-is" basis without warranty of any kind and any express or implied warranties, including, but not limited to, the implied warranties of merchantability and fitness for a particular purpose are disclaimed. In no event shall wnpd (or KeaDrone)be liable for any direct, indirect, incidental, special, exemplary, or consequential damages (including, but not limited to, procurement of substitute goods or services; loss of use, data, or profits; or business interruption) however caused and on any theory of liability, whether in contract, strict liability, or tort (including negligence or otherwise) arising in any way out of the use of this firmware, hardware, software or information, even if wnpd (or KeaDrone) has been advised by user of the possibility of such potential loss or damage. The user agrees to hold wnpd (or KeaDrone) harmless from and against any and all claims, losses, liabilities and expenses.
- Title
- Size:
- Date:
- A4
- Name:
- Time:
- Ing. W. Pietersz
- Revision:
- Sheet
- of
- WillyPietersz@gmail.com
- Contact:
- -
- www.wnpd.nl
- File:

### Library data of the parts
C13 = 100n: as C?#2 on sheet GYRO 3-AXIS - ITG-3200; Part Number: 100n; Value: 100n; Package: 0805; Component Type: Standard; LatestRevision Date: 31-7-2010; Author: Willy Pietersz; Supplier 2: Farnell; Supplier Part Number 2: 1759266; ComponentLink1Description: Manufacturer; ComponentLink2Description: Datasheet
P8 = GPS-LS20031: Header, 6-Pin; GPS; 1mm pitch; SMT; SH connector; Crimp; LatestRevisionDate: 17-Jul-2002; LatestRevisionNote: Re-released for DXP Platform.; Publisher: Altium Limited; Part Number: GPS-LS20031; Number Of Pins: 6
P9 = PH1x4: Con1x4; Part Number: PH1x4; Pitch: 2.54; LatestRevision Note: Initial Release; Type: Pin Header; Number Of Pins: 4; Component Type: Standard; LatestRevision Date: 23-11-2010; Author: Willy Pietersz; Supplier 2: Farnell

## Nets that join several sheets
3v3-zigbee: Zigbee interface (P10.1 U7.1), U_Subsheets combined/U_Zigbee interface/PSU 3v3-xBee (C15C.2 C16C.2 U6C.3)
3v3A: Accelerometer 3-AXIS - BMA180 (C1.2 U1.2), U_Subsheets combined/PSU 3v3A (C15B.2 C16B.2 U6B.3)
5v0: Subsheets combined (5 pins), SMPS 1000mA - LM22672 (5 pins), U_Subsheets combined/PSU 3v3 (C14A.2 U6A.2), U_Subsheets combined/PSU 3v3A (C14B.2 U6B.2), U_Subsheets combined/U_Zigbee interface/PSU 3v3-xBee (C14C.2 U6C.2), U_Subsheets combined/ServoConnector1 (P?A.2), U_Subsheets combined/ServoConnector2 (P?B.2), U_Subsheets combined/ServoConnector3 (P?C.2), U_Subsheets combined/ServoConnector4 (P?D.2), U_Subsheets combined/ServoConnector5 (P?E.2), U_Subsheets combined/ServoConnector6 (P?F.2), U_Subsheets combined/ServoConnector7 (P?G.2), U_Subsheets combined/ServoConnector8 (P?H.2)
CS1: Subsheets combined (D4.1), Accelerometer 3-AXIS - BMA180 (7 pins), GYRO 3-AXIS - ITG-3200 (7 pins), U_Subsheets combined/PSU 3v3 (C15A.2 C16A.2 U6A.3), GPS Connector - LS20031 (C13.2 P8.A1 P9.1)
GND: Subsheets combined (15 pins), GYRO 3-AXIS - ITG-3200 (9 pins), SMPS 1000mA - LM22672 (11 pins), U_Subsheets combined/PSU 3v3 (C14A.1 C15A.1 C16A.1 U6A.1), Power Entry 24v-3pin Fused-1A5 (P3.1), Zigbee interface (P10.5 U7.10), U_Subsheets combined/U_Zigbee interface/PSU 3v3-xBee (C14C.1 C15C.1 C16C.1 U6C.1), U_Subsheets combined/ServoConnector1 (P?A.1), U_Subsheets combined/ServoConnector2 (P?B.1), U_Subsheets combined/ServoConnector3 (P?C.1), U_Subsheets combined/ServoConnector4 (P?D.1), U_Subsheets combined/ServoConnector5 (P?E.1), U_Subsheets combined/ServoConnector6 (P?F.1), U_Subsheets combined/ServoConnector7 (P?G.1), U_Subsheets combined/ServoConnector8 (P?H.1), GPS Connector - LS20031 (5 pins)
GNDA: Subsheets combined (R10.1), Accelerometer 3-AXIS - BMA180 (C1.1 C2.1 P1.7 U1.3), U_Subsheets combined/PSU 3v3A (C14B.1 C15B.1 C16B.1 U6B.1)
Input 11.1v: Subsheets combined (SW4.1), Power Entry 24v-3pin Fused-1A5 (D1.2)
Input 11.1v-AfterSw: Subsheets combined (SW4.2), SMPS 1000mA - LM22672 (C9.2 C10.2 P5.2 U3.7)
SCK: Accelerometer 3-AXIS - BMA180 (P1.4 U1.7), GYRO 3-AXIS - ITG-3200 (P?.2 R?#2.2 U?.23)
SDA: Accelerometer 3-AXIS - BMA180 (P1.2 U1.9), GYRO 3-AXIS - ITG-3200 (P?.3 R?#1.2 U?.24)